# EAGLE design ESP32-Cam-Pico-V2 (EAGLE 9.6.2)
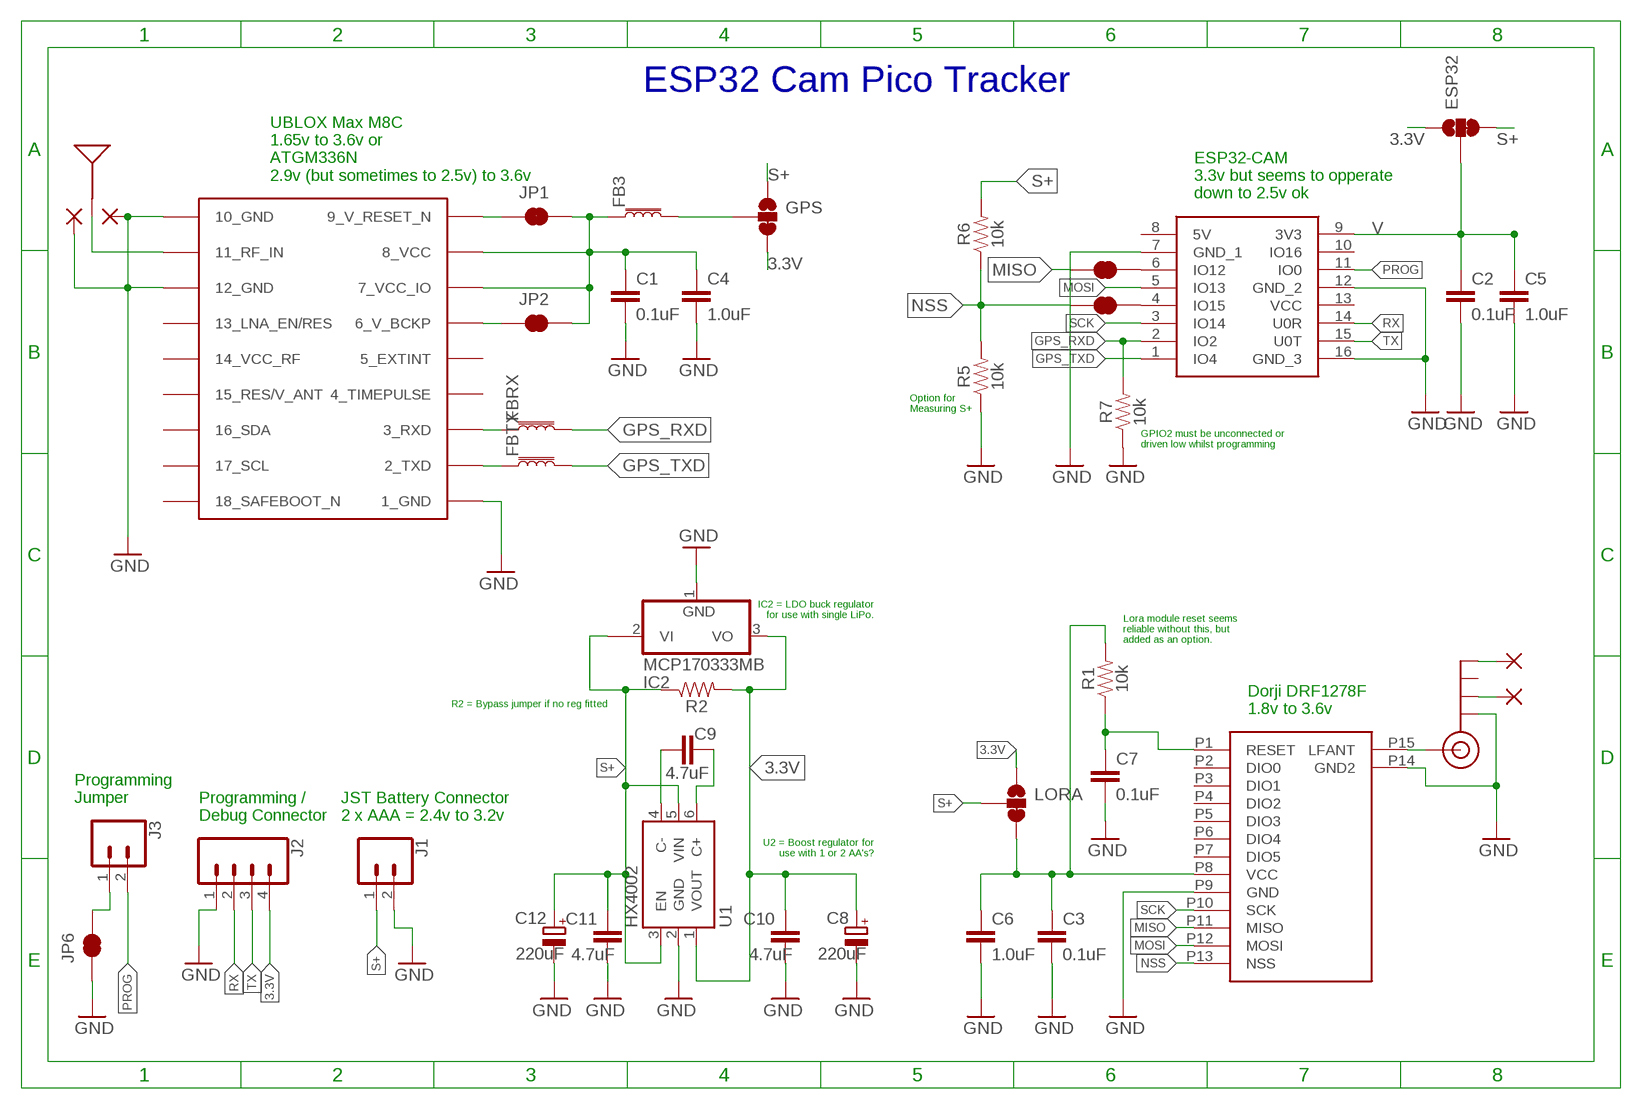
[diagram p0: schematic, sheet 1]

## Parts
C1  0.1uF  0.1UF-0402-6.3V-10%-X7R  [0402]
C2  0.1uF  0.1UF-0402-6.3V-10%-X7R  [0402]
C3  0.1uF  0.1UF-0402-6.3V-10%-X7R  [0402]
C4  1.0uF  1.0UF-0402-16V-10%  [0402]
C5  1.0uF  1.0UF-0402-16V-10%  [0402]
C6  1.0uF  1.0UF-0402-16V-10%  [0402]
C7  0.1uF  0.1UF-0402-6.3V-10%-X7R  [0402]
C8  220uF  CPOL-EUSMCC  [SMC_C]
C9  4.7uF  1.0UF-0402-16V-10%  [0402]
C10  4.7uF  1.0UF-0402-16V-10%  [0402]
C11  4.7uF  1.0UF-0402-16V-10%  [0402]
C12  220uF  CPOL-EUSMCC  [SMC_C]
ESP32  JUMPER-SMT_3_1-NC_TRACE_SILK  [SMT-JUMPER_3_1-NC_TRACE_SILK]
FB3  FERRITE_BEAD-120_OHM-0402  [0402]
FBRX  FERRITE_BEAD-120_OHM-0402  [0402]
FBTX  FERRITE_BEAD-120_OHM-0402  [0402]
GPS  JUMPER-SMT_3_1-NC_TRACE_SILK  [SMT-JUMPER_3_1-NC_TRACE_SILK]
IC1  ESP32-CAM  [ESP32CAM]
IC2  MCP170333MB  [SOT89]
J1  CONN_02JST-PTH-2-KIT  [JST-2-PTH-KIT]
J2  CONN_04LOCK  [1X04_LOCK]
J3  CONN_02LOCK  [1X02_LOCK]
J$1  SMA_EDGE  [SMA-EDGE]
JP1  JUMPER-SMT_2_NC_TRACE_NO-SILK  [SMT-JUMPER_2_NC_TRACE_NO-SILK]
JP2  JUMPER-SMT_2_NC_TRACE_NO-SILK  [SMT-JUMPER_2_NC_TRACE_NO-SILK]
JP6  JUMPER-SMT_2_NC_TRACE_NO-SILK  [SMT-JUMPER_2_NC_TRACE_NO-SILK]
JP9  JUMPER-SMT_2_NC_TRACE_NO-SILK  [SMT-JUMPER_2_NC_TRACE_NO-SILK]
JP10  JUMPER-SMT_2_NC_TRACE_NO-SILK  [SMT-JUMPER_2_NC_TRACE_NO-SILK]
LORA  JUMPER-SMT_3_1-NC_TRACE_SILK  [SMT-JUMPER_3_1-NC_TRACE_SILK]
PAD1  1,6/0,8  [1,6/0,8]
PAD2  1,6/0,8  [1,6/0,8]
PAD3  1,6/0,8  [1,6/0,8]
PAD4  1,6/0,8  [1,6/0,8]
R1  10k  10KOHM-0402-1/16W-1%  [0402]
R2  0k  10KOHM-0402-1/16W-1%  [0402]
R5  10k  10KOHM-0402-1/16W-1%  [0402]
R6  10k  10KOHM-0402-1/16W-1%  [0402]
R7  10k  10KOHM-0402-1/16W-1%  [0402]
U1  HX4002  CE021SOT-23  [SOT23-6]
U$1  MAX-M8  [MAX-M8]
U$2  1.575GHz  ANTENNAGPS-2X7MM  [ANT-GPS-2X7MM]
U$3  DRF1278F_2LESS_PINS  [DRF1278F_2_LESS_PINS]

## Nets
3.3V: C8.+ C10.1 ESP32.1 GPS.3 IC2.3(VO) J2.4 LORA.1 R2.2 U1.1(VOUT)
ANT: J$1.SIG(SIGNAL) U$3.P15(LFANT)
GND: C1.2 C2.2 C3.2 C4.2 C5.2 C6.2 C7.2 C8.- C10.2 C11.2 C12.- IC1.7(GND_1) IC1.12(GND_2) IC1.16(GND_3) IC2.1(GND) J1.2 J2.1 J$1.GND@0(GND) JP6.1 PAD1.1(P) PAD2.1(P) R5.1 R7.1 U1.2(GND) U$1.1_GND U$1.10_GND U$1.12_GND U$3.P9(GND) U$3.P14(GND2)
GPS_RXD: FBRX.2 IC1.2(IO2) R7.2
GPS_TXD: FBTX.2 IC1.1(IO4)
MISO: JP9.1 U$3.P11(MISO)
MOSI: IC1.5(IO13) U$3.P12(MOSI)
N$1: U$1.11_RF_IN U$2.1(SIGNAL)
N$2: FBRX.1 U$1.3_RXD
N$3: FBTX.1 U$1.2_TXD
N$4: J$1.GND@3(GND) PAD3.1(P)
N$5: JP1.1 U$1.9_RESET_N(9_V_RESET_N)
N$6: JP2.1 U$1.6_V_BCKP
N$7: J$1.GND@1(GND) PAD4.1(P)
N$8: C7.1 R1.1 U$3.P1(RESET)
N$9: FB3.2 GPS.2
N$11: C1.1 C4.1 FB3.1 JP1.2 JP2.2 U$1.7_VCC_IO U$1.8_VCC
N$12: C9.2 U1.4(C-)
N$15: J3.1 JP6.2
N$17: C9.1 U1.6(C+)
N$18: IC1.6(IO12) JP9.2
N$20: IC1.4(IO15) JP10.2
NSS: JP10.1 R5.2 R6.1 U$3.P13(NSS)
PROG: IC1.11(IO0) J3.2
RX: IC1.14(U0R) J2.2
S+: C3.1 C6.1 C11.1 C12.+ ESP32.3 GPS.1 IC2.2@1(VI1) J1.1 LORA.2 LORA.3 R1.2 R2.1 R6.2 U1.3(EN) U1.5(VIN) U$3.P8(VCC)
SCK: IC1.3(IO14) U$3.P10(SCK)
TX: IC1.15(U0T) J2.3
V: C2.1 C5.1 ESP32.2 IC1.9(3V3)
Unconnected: IC1.8(5V) IC1.10(IO16) IC1.13(VCC) IC2.2(VI) J$1.GND@2(GND) U$1.4_TIMEPULSE U$1.5_EXTINT U$1.13_LNA_EN(13_LNA_EN/RES) U$1.14_VCC_RF U$1.15_V_ANT/RESERVED(15_RES/V_ANT) U$1.16_SDA U$1.17_SCL U$1.18_SAFEBOOT_N U$3.P2(DIO0) U$3.P3(DIO1) U$3.P4(DIO2) U$3.P5(DIO3) U$3.P6(DIO4) U$3.P7(DIO5)

## Notes on the sheet
- ESP32 Cam Pico Tracker
- UBLOX Max M8C
  1.65v to 3.6v or
  ATGM336N
  2.9v (but sometimes to 2.5v) to 3.6v
- ESP32-CAM
  3.3v but seems to opperate
  down to 2.5v ok
- Option for 
  Measuring S+
- GPIO2 must be unconnected or
  driven low whilst programming
- IC2 = LDO buck regulator
  for use with single LiPo.
- Lora module reset seems 
  reliable without this, but 
  added as an option.
- R2 = Bypass jumper if no reg fitted
- Dorji DRF1278F
  1.8v to 3.6v
- Programming
  Jumper
- Programming / 
  Debug Connector
- JST Battery Connector
  2 x AAA = 2.4v to 3.2v
- U2 = Boost regulator for
  use with 1 or 2 AA's?

## Library data of the parts
C1-C3 C7 = SparkFun-Capacitors:0.1UF: 0.1µF ceramic capacitors A capacitor is a passive two-terminal electrical component used to store electrical energy temporarily in an electric field.; PROD_ID: CAP-14993
C4-C6 = SparkFun-Capacitors:1.0UF: 1µF ceramic capacitors A capacitor is a passive two-terminal electrical component used to store electrical energy temporarily in an electric field.; PROD_ID: CAP-12417
C8 C12 = rcl:CPOL-EU: POLARIZED CAPACITOR, European symbol; SPICEPREFIX: C
C9-C11 = SparkFun-Capacitors:1.0UF: 1µF ceramic capacitors A capacitor is a passive two-terminal electrical component used to store electrical energy temporarily in an electric field.; PROD_ID: CAP-12417; VALUE: 1.0uF
ESP32 GPS LORA = SparkFun-Jumpers:JUMPER-SMT_3_1-NC_TRACE: Normally closed trace jumper (1 of 2 connections) This jumper has a trace between two pads so it's normally closed (NC). The other connection is normally open (NO). Use a razor knife to open the connection. For best results follow the IPC guidelines for cutting traces: Cutout at least 0.063 mm (0.005 in). Remove all loose material to clean up the cut area. Seal the cut with an approved epoxy. Reapply solder to reclose the connection, or to close the NO connection.
FB3 FBRX FBTX = SparkFun-Coils:FERRITE_BEAD-120_OHM: Ferrite Bead (blocks, cores, rings, chokes, etc.) Inductor with layers of ferrite used to suppress high frequencies. Often used to isolate high frequency noise.; MFG_PART: BLM15HB121SN1D; PROD_ID: NDUC-14206
IC1 = ESP32-CAM:ESP32-CAM: Modules PCBA Module RoHS Source: Datasheet <https://datasheet.lcsc.com/szlcsc/Ai-Thinker-ESP32-CAM_C277946.pdf>; DESCRIPTION: Modules PCBA Module RoHS; HEIGHT: 5mm; MANUFACTURER_NAME: Ai-Thinker; MANUFACTURER_PART_NUMBER: ESP32-CAM
IC2 = linear:MCP1703*: 250 mA, 16V, Low Quiescent Current LDO Regulator Source: http://ww1.microchip.com/downloads/en/DeviceDoc/22049b.pdf
J1 J3 = SparkFun-Connectors:CONN_02: Multi connection point. Often used as Generic Header-pin footprint for 0.1 inch spaced/style header connections On any of the 0.1 inch spaced packages, you can populate with these: Break Away Headers - Straight <https://www.sparkfun.com/products/116> (PRT-00116) Break Away Male Headers - Right Angle <https://www.sparkfun.com/products/553> (PRT-00553) Female Headers <https://www.sparkfun.com/products/115> (PRT-00115) Break Away Headers - Machine Pin <https://www.sparkfun.com/products/117> (PRT-00117) Break Away Female Headers - Swiss Machine Pin <https://www.sparkfun.com/products/743> (PRT-00743) For SCREWTERMINALS and SPRING TERMINALS visit here: Screw Terimnals on SparkFun.com <https://www.sparkfun.com/search/results?term=Screw+Terminals> (5mm/3.5mm/2.54mm spacing) This device is also useful as a general connection point to wire up your design to another part of your project. Our various solder wires solder well into these plated through hole pads. Hook-Up Wire - Assortment (Stranded, 22 AWG) <https://www.sparkfun.com/products/11375> (PRT-11375) Hook-Up Wire - Assortment (Solid Core, 22 AWG) <https://www.sparkfun.com/products/11367> (PRT-11367) View the entire wire category on our website here <https://www.sparkfun.com/categories/141> Special notes: Molex polarized connector foot print use with: PRT-08233 with associated crimp pins and housings. 2.54_SCREWTERM for use with PRT-10571. 3.5mm Screw Terminal footprints for PRT-08084 5mm Screw Terminal footprints for use with PRT-08432
J2 = SparkFun-Connectors:CONN_04: Multi connection point. Often used as Generic Header-pin footprint for 0.1 inch spaced/style header connections On any of the 0.1 inch spaced packages, you can populate with these: Break Away Headers - Straight <https://www.sparkfun.com/products/116> (PRT-00116) Break Away Male Headers - Right Angle <https://www.sparkfun.com/products/553> (PRT-00553) Female Headers <https://www.sparkfun.com/products/115> (PRT-00115) Break Away Headers - Machine Pin <https://www.sparkfun.com/products/117> (PRT-00117) Break Away Female Headers - Swiss Machine Pin <https://www.sparkfun.com/products/743> (PRT-00743) For SCREWTERMINALS and SPRING TERMINALS visit here: Screw Terimnals on SparkFun.com <https://www.sparkfun.com/search/results?term=Screw+Terminals> (5mm/3.5mm/2.54mm spacing) This device is also useful as a general connection point to wire up your design to another part of your project. Our various solder wires solder well into these plated through hole pads. Hook-Up Wire - Assortment (Stranded, 22 AWG) <https://www.sparkfun.com/products/11375> (PRT-11375) Hook-Up Wire - Assortment (Solid Core, 22 AWG) <https://www.sparkfun.com/products/11367> (PRT-11367) View the entire wire category on our website here <https://www.sparkfun.com/categories/141> Special notes: Molex polarized connector foot print use with SKU : PRT-08231 with associated crimp pins and housings. 1MM SMD Version SKU: PRT-10208; PROD_ID: CONN-09696
J$1 = SparkFun-Retired:SMA_EDGE: SMA Antenna Connector End launch SMA connector. The paste layer has been removed so that the connector can be hand soldered onto the board after reflow.
JP1 JP2 JP6 JP9 JP10 = SparkFun-Jumpers:JUMPER-SMT_2_NC_TRACE: Normally closed trace jumper This jumper has a trace between two pads so it's normally closed (NC). Use a razor knife to open the connection. For best results follow the IPC guidelines for cutting traces: Cutout at least 0.063 mm (0.005 in). Remove all loose material to clean up the cut area. Seal the cut with an approved epoxy. Reapply solder to reclose the connection.
PAD1-PAD4 = wirepad:1,6/0,8: THROUGH-HOLE PAD
R1 R5-R7 = SparkFun-Resistors:10KOHM: 10kΩ resistor A resistor is a passive two-terminal electrical component that implements electrical resistance as a circuit element. Resistors act to reduce current flow, and, at the same time, act to lower voltage levels within circuits. - Wikipedia; PROD_ID: RES-14241
R2 = SparkFun-Resistors:10KOHM: 10kΩ resistor A resistor is a passive two-terminal electrical component that implements electrical resistance as a circuit element. Resistors act to reduce current flow, and, at the same time, act to lower voltage levels within circuits. - Wikipedia; PROD_ID: RES-14241; VALUE: 10k
U1 = KEW_HF_V13a:CE021: CE021 Hexin 3.3v Boost/Buck, SOT23-6 Datasheet <http://www.jiecx.com/files856985665897965/productpdf/2013-7-5/545010255.pdf>
U$1 = ubloxLib:MAX-M8: u-blox MAX GNSS module
U$2 = SparkFun-GPS:ANTENNA: Single-ended Antennae 1.575GHz antennae with just one terminal. These are all chip antennae. 1575MHz (GPS) Antennae ANT-GPS-2X7MM - 2.0 x 7.0 mm chip antenna. (SparkFun Product <https://www.sparkfun.com/products/9131>) ANT-GPS-2X8MM - 2.0 x 8.0 mm chip antenna. (SparkFun Product <https://www.sparkfun.com/products/8418>); PROD_ID: ANT-09087; SF_ID: GPS-09131
U$3 = DRF1278F:DRF1278F_2

## Board
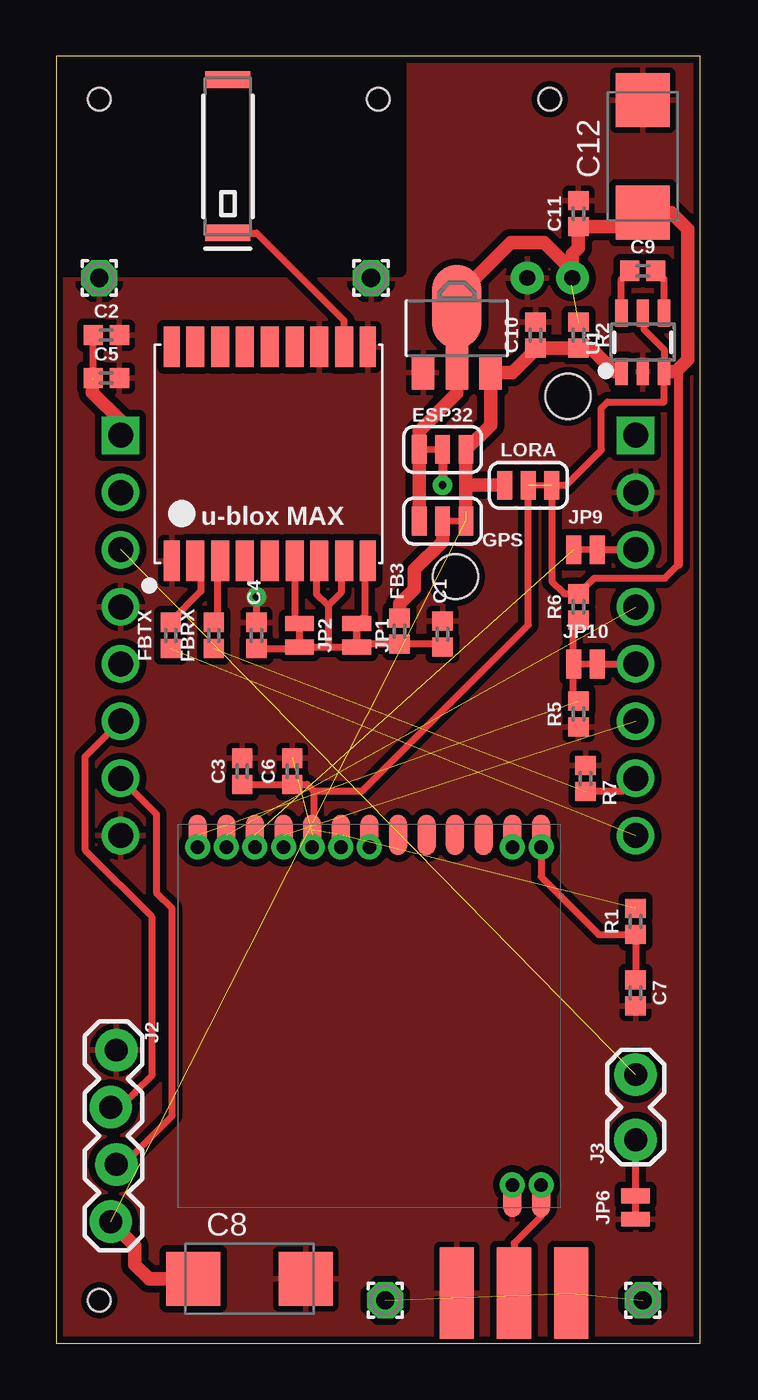
[diagram p1: board, top side]
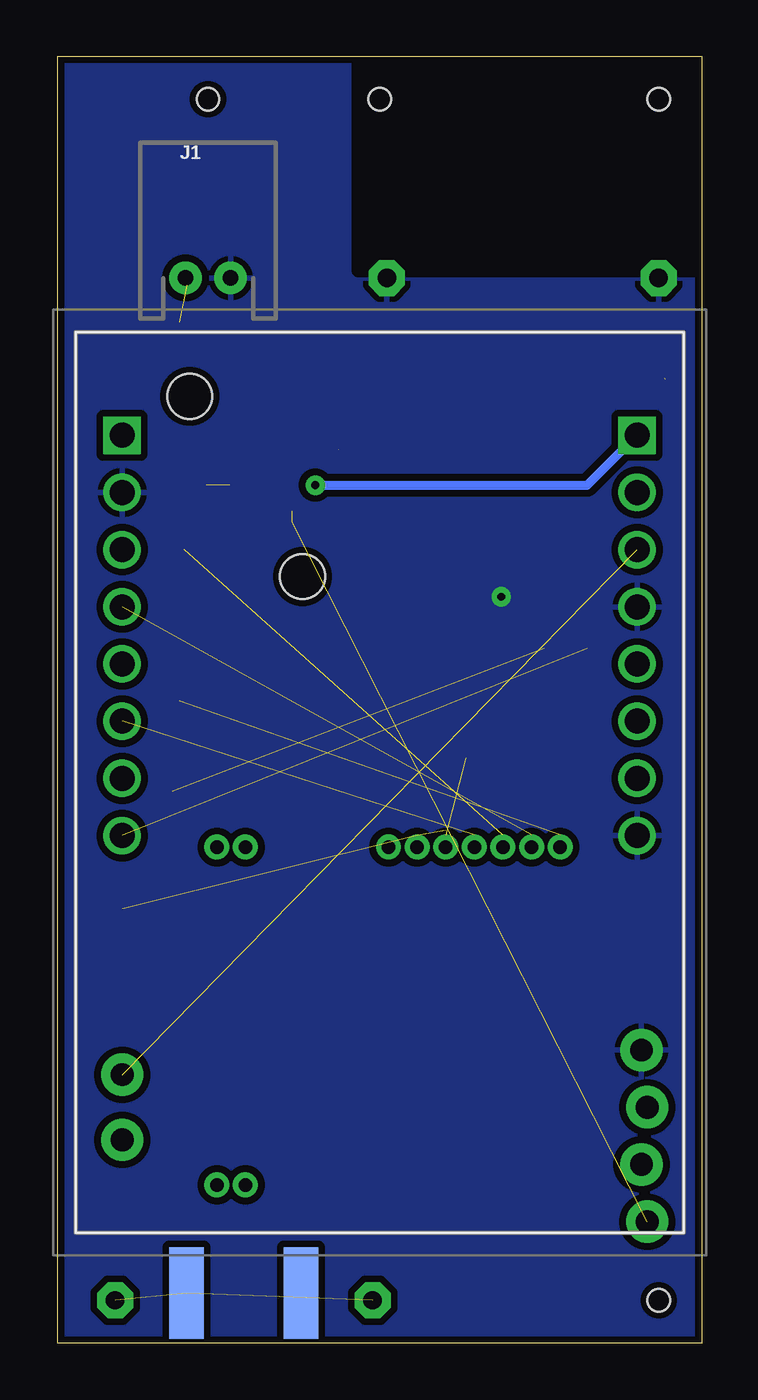
[diagram p2: board, bottom side, seen from below]

Size 28.57 x 57.15 mm. Coordinates in mm from the lower left corner, seen from the top.
Outline: 0,0 28.57,0 28.57,57.15 0,57.15 0,0
Copper layers (1*16): Top 0.035mm / dielectric 1.5mm / Bottom 0.035mm
Design rules "SparkFun-2-layer-STANDARD": minimum track width 10mil, minimum drill 20mil, track to track 10mil, track to pad 8mil, pad to pad 8mil, via to via 10mil, smd to smd 8mil, copper to edge 8mil, drill to drill 8mil, minimum pad ring 10mil, minimum via ring 10mil, stop-mask expansion 4mil, vias tented up to drill 25mil, thermal gap 10mil
Holes 1 mm at 1.91,55.24 14.29,55.24 1.91,1.91 21.91,55.24
tKeepout: area 0,47.6 to 15.2,57.2
bKeepout: area 0,47.6 to 15.2,57.2
tRestrict: area 0,47.6 to 15.2,57.2
bRestrict: area 0,47.6 to 15.2,57.2

### Footprints (pad centres in the part's own frame; a part is rotated, then mirrored left to right if it is on the bottom)
0402 = smd 0.85 x 0.9: 1 -0.58,0; 2 0.58,0
SMC_C = smd 2.4 x 2.4: + -2.5,0; - 2.5,0
SMT-JUMPER_3_1-NC_TRACE_SILK = smd 0.66 x 1.27: 1 -1.041,0; 2 0,0; 3 1.041,0
ESP32CAM = drill 1.11 pad 1.665: 1 0,0; 2 0,2.54; 3 0,5.08; 4 0,7.62; 5 0,10.16; 6 0,12.7; 7 0,15.24; 10 22.86,15.24; 11 22.86,12.7; 12 22.86,10.16; 13 22.86,7.62; 14 22.86,5.08; 15 22.86,2.54; 16 22.86,0 | drill 1.11 pad 1.665 square: 8 0,17.78; 9 22.86,17.78 | hole 2: 3,19.508; 8,11.508
SOT89 = smd 1 x 1.5: 1 -1.499,-1.981; 3 1.499,-1.981 | smd 1 x 2: 2 0,-1.727 | smd 2.2 x 3.7: 2@1 0,0.94
JST-2-PTH-KIT = drill 0.7 pad 1.448: 1 -1,0; 2 1,0
1X04_LOCK = drill 1.016 pad 1.88: 1 0,0.127; 2 2.54,-0.127; 3 5.08,0.127; 4 7.62,-0.127
1X02_LOCK = drill 1.016 pad 1.88: 1 -0.178,0; 2 2.718,0
SMA-EDGE = smd 1.524 x 4.064: GND@0 0,0; GND@1 5.08,0; SIG 2.54,0 | smd 1.524 x 4.064 bottom: GND@2 0,0; GND@3 5.08,0
SMT-JUMPER_2_NC_TRACE_NO-SILK = smd 0.66 x 1.27: 1 -0.521,0; 2 0.521,0
1,6/0,8 = drill 0.813 pad 1.6 octagon: 1 0,0
SOT23-6 = smd 0.55 x 1.2: 1 0.95,1.3; 2 0,1.3; 3 -0.95,1.3; 4 -0.95,-1.3; 5 0,-1.3; 6 0.95,-1.3
MAX-M8 = smd 1.8 x 0.7: 1_GND 4.95,-4.4; 9_RESET_N 4.95,4.3; 10_GND -4.55,4.3; 18_SAFEBOOT_N -4.55,-4.4 | smd 1.8 x 0.8: 2_TXD 4.95,-3.35; 3_RXD 4.95,-2.25; 4_TIMEPULSE 4.95,-1.15; 5_EXTINT 4.95,-0.05; 6_V_BCKP 4.95,1.05; 7_VCC_IO 4.95,2.15; 8_VCC 4.95,3.25; 11_RF_IN -4.55,3.25; 12_GND -4.55,2.15; 13_LNA_EN -4.55,1.05; 14_VCC_RF -4.55,-0.05; 15_V_ANT/RESERVED -4.55,-1.15; 16_SDA -4.55,-2.25; 17_SCL -4.55,-3.35
ANT-GPS-2X7MM = smd 0.75 x 2: 1 -3.4,0; NC 3.4,0
DRF1278F_2_LESS_PINS = drill 0.6 pad 0.85: 1 16.12,16; 2 14.85,16; 7 8.5,16; 8 7.23,16; 9 5.96,16; 10 4.69,16; 11 3.42,16; 12 2.15,16; 13 0.88,16; 14 14.85,1; 15 16.12,1 | smd 0.8 x 1.8: P1 16.12,16.53; P2 14.85,16.53; P3 13.57,16.53; P4 12.3,16.53; P5 11.04,16.53; P6 9.78,16.53; P7 8.5,16.53; P8 7.23,16.53; P9 5.96,16.53; P10 4.69,16.53; P11 3.42,16.53; P12 2.15,16.53; P13 0.88,16.53; P14 14.85,0.48; P15 16.12,0.48

### Placement (x,y rotation side)
C1  17.14,31.5 90 top
C2  2.22,44.77 0 top
C3  8.26,25.4 90 top
C4  8.89,31.43 90 top
C5  2.22,42.86 0 top
C6  10.48,25.4 90 top
C7  25.72,15.56 270 top
C8  8.57,2.86 0 top
C9  26.04,47.62 0 top
C10  21.27,44.77 90 top
C11  23.18,50.16 90 top
C12  26.04,52.7 90 top
ESP32  17.14,39.69 180 top
FB3  15.24,31.62 90 top
FBRX  6.99,31.43 270 top
FBTX  5.08,31.43 270 top
GPS  17.14,36.51 0 top
IC1  25.72,22.54 0 bottom
IC2  17.78,45.09 0 top
J1  21.91,47.31 0 bottom
J2  2.54,13.02 270 top
J3  25.72,9.21 90 top
J$1  17.78,2.22 0 top
JP1  13.34,31.43 270 top
JP2  10.79,31.43 270 top
JP6  25.72,6.03 90 top
JP9  23.5,35.24 0 top
JP10  23.5,30.16 0 top
LORA  20.95,38.1 0 top
PAD1  1.91,47.31 0 top
PAD2  13.97,47.31 0 top
PAD3  14.61,1.91 0 top
PAD4  26.04,1.91 0 top
R1  25.72,18.73 90 top
R2  23.18,44.77 270 top
R5  23.18,27.94 90 top
R6  23.18,32.7 90 top
R7  23.5,25.08 270 top
U1  26.04,44.45 180 top
U$1  9.53,39.69 270 top
U$2  7.62,52.7 90 top
U$3  5.4,6.03 0 top

### Tracks (layer width: path | path; a pad name or v marks a point on that pad's centre or on a via)
3.3V  (2 unrouted)
  Top 0.61: U1.1 24.77,43.15 23.73,44.19 R2.2 C10.1 21.27,44.15 20.23,43.1 IC2.3 19.28,40.78 ESP32.1 18.19,38.1 | J2.4 3.49,4.32 3.49,3.49 4.13,2.86 C8.+ | 18.19,38.1 18.19,36.96 | 18.19,38.1 LORA.1
ANT
  Top 0.305: U$3.P15 21.52,5.64 20.32,4.45 J$1.SIG
GND  (via drill 0.35 pad 0.6)  (1 unrouted)
  Top 0.305: C4.2 v8.89,33.15
  pour Top (isolate 0.305): 0,57.15 0,0 28.57,0 28.57,57.15
  pour Bottom (isolate 0.305): 0,57.15 0,0 28.57,0 28.57,57.15
GPS_RXD  (1 unrouted)
  Top 0.305: IC1.2 25.14,24.5 R7.2
GPS_TXD  (1 unrouted)
MISO  (1 unrouted)
MOSI  (1 unrouted)
N$1
  Top 0.305: U$2.1 8.89,49.3 12.78,45.42 U$1.11_RF_IN
N$2
  Top 0.305: U$1.3_RXD 7.15,34.61 7.15,32.17 FBRX.1
N$3
  Top 0.305: U$1.2_TXD 6.42,34.5 6.42,33.39 5.08,32.06 FBTX.1
N$4  (1 unrouted)
N$5
  Top 0.305: U$1.9_RESET_N 13.7,34.61 13.7,32.32 JP1.1
N$6
  Top 0.305: U$1.6_V_BCKP 10.57,32.17 JP2.1
N$7  (1 unrouted)
N$8
  Top 0.305: C7.1 R1.1 24.07,18.15 21.52,20.71 U$3.P1
N$9
  Top 0.61: GPS.2 17.14,35.61 15.89,34.36 15.89,33.49 15.24,32.84 FB3.2
N$11
  Top 0.305: 12.06,30.91 JP2.2 10.74,30.85 C4.1 | 12.06,30.91 JP1.2 13.47,31.04 FB3.1 17.02,31.04 C1.1 | 12.06,32.76 11.55,33.28 11.55,34.61 U$1.7_VCC_IO | 12.06,32.76 12.06,30.91 | U$1.8_VCC 12.65,34.61 12.65,33.34 12.06,32.76
N$12
  Top 0.305: U1.4 26.98,47.26 C9.2
N$15
  Top 0.305: JP6.2 J3.1
N$17
  Top 0.305: U1.6 25.09,47.26 C9.1
N$18
  Top 0.305: JP9.2 IC1.6
N$20
  Top 0.305: JP10.2 IC1.4
NSS  (1 unrouted)
  Top 0.305: R6.1 22.92,31.87 22.92,30.21 JP10.1 22.92,30.11 22.92,28.77 R5.2
PROG  (1 unrouted)
RX
  Top 0.305: IC1.14 1.27,26.04 1.27,21.91 4.23,18.95 4.23,11.87 3.49,11.13 3.49,11.11 2.86,10.48 J2.2
S+  (5 unrouted)
  Top 0.305: 11.43,24.52 11.13,24.82 C6.1 C3.1 8.26,24.55 | 11.43,24.52 11.43,22.86 11.36,22.79 | 11.43,24.52 13.58,24.52 20.95,31.9 LORA.2 | U1.5 26.09,45.7 26.09,45.02 26.98,44.13 U1.3 | 27.62,34.58 27.01,33.98 23.87,33.98 R6.2 22.54,33.28 22,33.83 LORA.3 22.63,38.1 24.2,39.67 24.2,41.53 24.46,41.8 26.98,41.8 U1.3 | 27.62,43.15 U1.3
  Top 0.406: 27.62,43.15 27.62,34.58
  Top 0.61: 25.8,50.2 C12.+ | U1.3 27.49,43.15 28.04,43.69 28.04,49.48 27.3,50.2 C12.+ | J1.1 22.86,47.26 22.86,46.99 | J1.1 22.91,47.62 | 22.91,47.62 22.91,48.36 23.18,48.63 C11.1 | C11.1 25.41,49.59 C12.+ | J1.1 22.91,47.61 | 23.18,48.95 C11.1 | 22.91,47.62 21.66,48.87 20.18,48.87 17.78,46.47 IC2.2@1 17.78,42.19 16.1,40.51 ESP32.3 | GPS.1 ESP32.3
SCK  (1 unrouted)
TX
  Top 0.305: J2.3 2.98,7.94 5.14,10.1 5.14,19.3 4.45,20 4.45,23.5 IC1.15
V  (via drill 0.35 pad 0.6)  (1 unrouted)
  Top 0.305: C5.1 C2.1
  Top 0.406: ESP32.2 v17.14,38.1
  Top 0.61: 1.6,42.82 1.6,42.22 2.86,40.97 IC1.9
  Bottom 0.406: v17.14,38.1 5.08,38.1 IC1.9